# Altium schematic sheet ESP32-C3_V1.SchDoc: ESP32-C3 Haptic Motor (part 3 of 3)
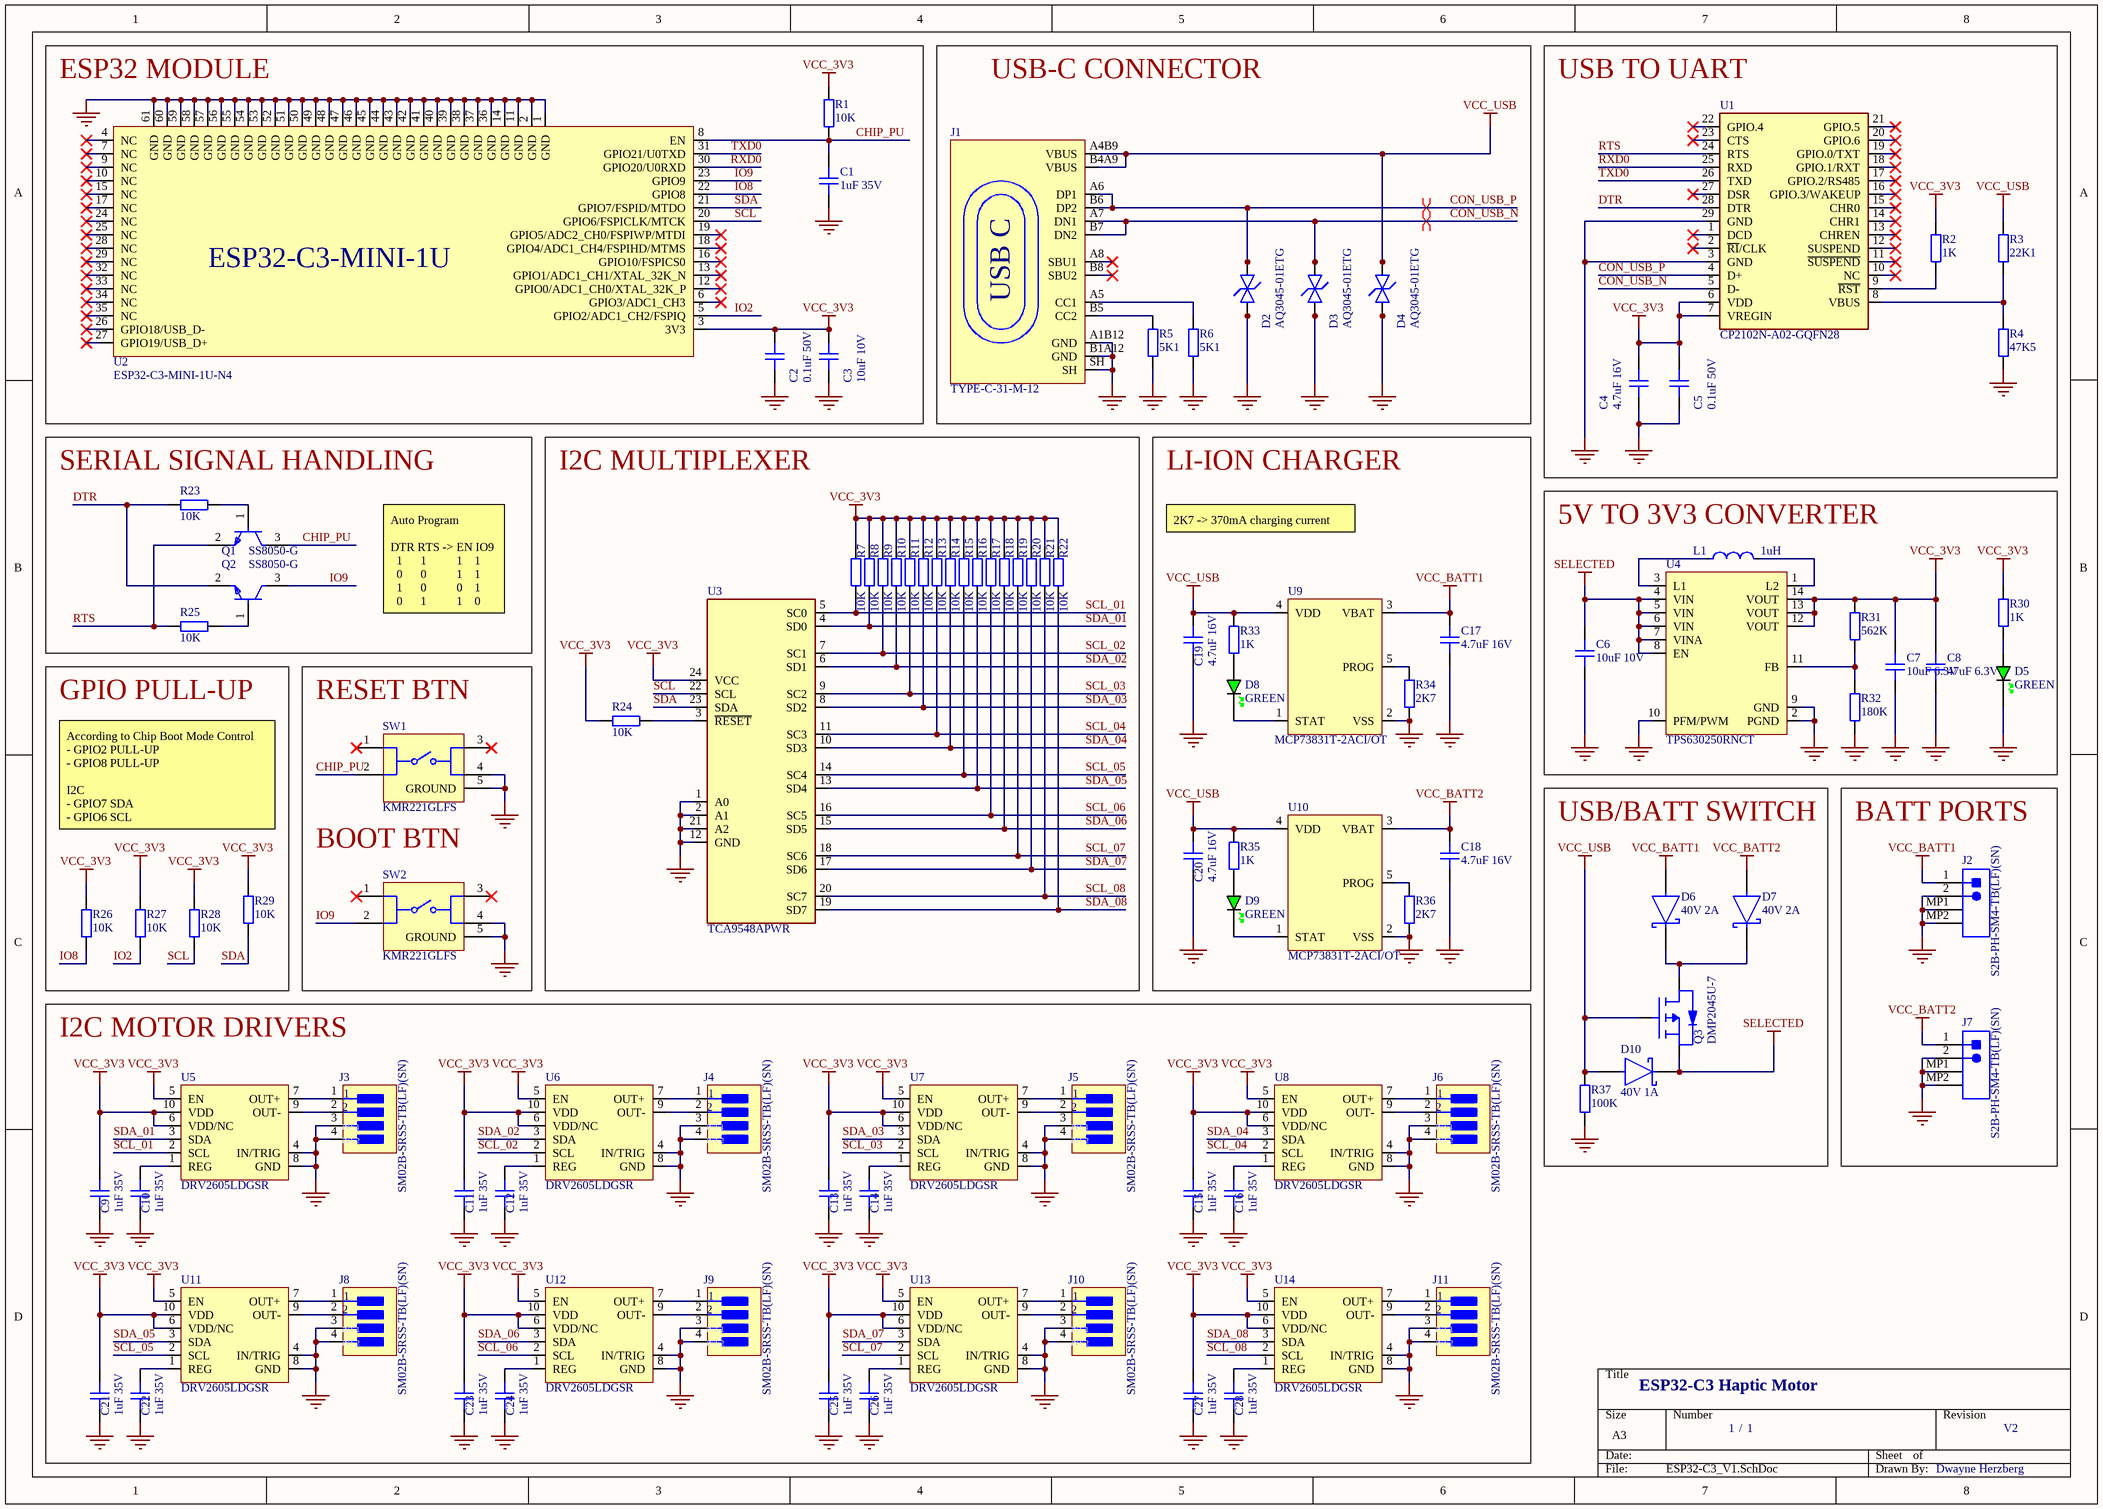
[diagram p2: ESP32-C3_V1.SchDoc]

## Library data of the parts (continued)
U3 = TCA9548APWR: IC BUS SWITCH 1 X 8:1 24TSSOP; Manufacturer: Texas Instruments; Package Body Material: Plastic; Output Polarity: True; Logic Type: MULTIPLEXER; Channels: 1; Number of Outputs: 8; Propagation Delay (tpd): 1ns; Max Supply Voltage: 5.5V; Min Supply Voltage: 1.65V; Nominal Supply Voltage: 1.8V; Supplier: Mouser; Supplier Part Number: 595-TCA9548APWR; Manufacturer Part Number: TCA9548APWR; RoHS: Yes; Category: Decoders and Multiplexers; Stock: 6650; Pricing: 1=1,17, 10=0,765, 50=0,765, 100=0,633, 1000=0,587, 10000=0,534 (USD); Case/Package: TSSOP; Pins: 24; Package Shape: Rectangular; Terminal Finish: Nickel; Min Operating Temperature: -40°C; Max Operating Temperature: 85°C; JESD-609 Code: e4; JESD-30 Code: R-PDSO-G24; Moisture Sensitivity Level: 1; Number of Inputs: 1; Package Style: SMALL OUTLINE, THIN PROFILE, SHRINK PITCHMeter; Peak Reflow Temperature (Cel): 260°C; Surface Mount: Yes; Terminal Form: Gull Wing; Terminal Position: DUAL; Length: 7.8mm; Width: 4.4mm; Height - Seated (Max): 1.2mm; Terminal Pitch: 0.65mm; Reach SVHC Compliant: Yes; RoHS Compliant: Yes; Temperature Grade: INDUSTRIAL; ComponentLink1URL: https://www.ti.com:443/lit/ds/symlink/tca9548a.pdf?src-supplier=IHS+Markit; ComponentLink1Description: https://www.ti.com:443/lit/ds/symlink/tca9548a.pdf?src-supplier=IHS+Markit; ComponentLink2URL: https://datasheet.ciiva.com/6614/tca9548a-6614721.pdf?src-supplier=Digikey; ComponentLink2Description: https://datasheet.ciiva.com/6614/tca9548a-6614721.pdf?src-supplier=Digikey; JLCPCB Part: C130026
U4 = TPS630250RNCT: IC REG BCK BST ADJ 2A/4A 14VQFN; Manufacturer: Texas Instruments; Package Body Material: Plastic; Throw Configuration: SWITCHING REGULATOR; Control Mode: CURRENT-MODE; Control Technique: PULSE WIDTH MODULATION; Max Supply Voltage: 5.5V; Min Input Voltage: 2.3V; Nominal Supply Voltage: 2.8V; Channels: 1; Switcher Configuration: BUCK-BOOST; Frequency: 2.5MHz; Supplier: Digikey; Supplier Part Number: 296-42036-1-ND; Manufacturer Part Number: TPS630250RNCT; RoHS: Yes; Category: Voltage Regulators - Switching; Stock: 15202; Pricing: 1=3,94, 10=2,977, 25=2,736, 100=2,4713 (USD); Case/Package: VQCCN; Pins: 14; Package Shape: Rectangular; Terminal Finish: Nickel; Min Operating Temperature: -40°C; Max Operating Temperature: 85°C; JESD-609 Code: e4; Moisture Sensitivity Level: 1; Package Style: CHIP CARRIER, VERY THIN PROFILEMeter; Surface Mount: Yes; Terminal Form: No Lead; Terminal Position: QUAD; Length: 3mm; Width: 2.5mm; Height - Seated (Max): 1mm; Terminal Pitch: 0.5mm; Temperature Grade: INDUSTRIAL; Reach SVHC Compliant: Yes; RoHS Compliant: Yes; ComponentLink1URL: https://www.ti.com:443/lit/ds/symlink/tps630250.pdf?src-supplier=IHS+Markit; ComponentLink1Description: https://www.ti.com:443/lit/ds/symlink/tps630250.pdf?src-supplier=IHS+Markit; ComponentLink2URL: http://www.ti.com/general/docs/lit/getliterature.tsp?genericPartNumber=TPS630250&&fileType=pdf&src-supplier=Element14; ComponentLink2Description: http://www.ti.com/general/docs/lit/getliterature.tsp?genericPartNumber=TPS630250&&fileType=pdf&src-supplier=Element14; ComponentLink3URL: http://www.ti.com/lit/ds/symlink/tps630250.pdf?src-supplier=Digikey; ComponentLink3Description: http://www.ti.com/lit/ds/symlink/tps630250.pdf?src-supplier=Digikey; ComponentLink4URL: http://www.ti.com/general/docs/lit/getliterature.tsp?genericPartNumber=TPS630251&&fileType=pdf&src-supplier=Avnet; ComponentLink4Description: http://www.ti.com/general/docs/lit/getliterature.tsp?genericPartNumber=TPS630251&&fileType=pdf&src-supplier=Avnet; ComponentLink5URL: http://www.ti.com/general/docs/lit/getliterature.tsp?genericPartNumber=TPS630250&amp;&amp;fileType=pdf&src-supplier=Farnell; ComponentLink5Description: http://www.ti.com/general/docs/lit/getliterature.tsp?genericPartNumber=TPS630250&amp;&amp;fileType=pdf&src-supplier=Farnell; JLCPCB Part: C2070882
U5-U8 U11-U14 = DRV2605LDGSR: IC MOTOR DRIVER 2V-5.5V 10VSSOP; Manufacturer: Texas Instruments; Package Body Material: Plastic; Throw Configuration: ANALOG CIRCUIT; Channels: 1; Max Supply Voltage: 5.2V; Min Supply Voltage: 2V; Nominal Supply Voltage: 3.6V; Supplier: Mouser; Supplier Part Number: 595-DRV2605LDGSR; Manufacturer Part Number: DRV2605LDGSR; RoHS: Yes; Category: Motor Drivers; Stock: 10057; Pricing: 1=2,27, 10=1,61, 50=1,61, 100=1,45, 1000=1,31, 10000=1,3 (USD); Case/Package: TSSOP; Pins: 10; Package Shape: Square; Terminal Finish: Nickel; Min Operating Temperature: -40°C; Max Operating Temperature: 85°C; JESD-609 Code: e4; JESD-30 Code: S-PDSO-G10; Moisture Sensitivity Level: 2; Package Style: SMALL OUTLINE, THIN PROFILE, SHRINK PITCHMeter; Peak Reflow Temperature (Cel): 260°C; Surface Mount: Yes; Terminal Form: Gull Wing; Terminal Position: DUAL; Length: 3mm; Width: 3mm; Height - Seated (Max): 1.1mm; Terminal Pitch: 0.5mm; Temperature Grade: INDUSTRIAL; Reach SVHC Compliant: Yes; RoHS Compliant: Yes; ComponentLink1URL: https://www.ti.com:443/lit/ds/symlink/drv2605l.pdf?src-supplier=IHS+Markit; ComponentLink1Description: https://www.ti.com:443/lit/ds/symlink/drv2605l.pdf?src-supplier=IHS+Markit; ComponentLink2URL: http://www.ti.com/lit/ds/symlink/drv2605l.pdf?src-supplier=Digikey; ComponentLink2Description: http://www.ti.com/lit/ds/symlink/drv2605l.pdf?src-supplier=Digikey; ComponentLink3URL: http://www.ti.com/general/docs/lit/getliterature.tsp?genericPartNumber=DRV2605L&&fileType=pdf&src-supplier=Avnet; ComponentLink3Description: http://www.ti.com/general/docs/lit/getliterature.tsp?genericPartNumber=DRV2605L&&fileType=pdf&src-supplier=Avnet; JLCPCB Part: C527464
U9 U10 = MCP73831T-2ACI/OT: IC BATT CNTL LI-ION 1CEL SOT23-5; Manufacturer: Microchip; Package Body Material: Plastic; Adjustable Threshold: Yes; Throw Configuration: POWER SUPPLY SUPPORT CIRCUIT; Number of Channels: 1; Package Equivalence Code: TSOP5/6,.11,37; Power Supplies: 3.3/5V; Supply Current-Max (Isup): 1.5mA; Max Supply Voltage: 6V; Min Supply Voltage: 3.75V; Nominal Supply Voltage: 5.2V; Time @ Peak Reflow Temperature-Max (s): 40s; Qualification Status: Not Qualified; Supplier: Digikey; Supplier Part Number: MCP73831T-2ACI/OTCT-ND; Manufacturer Part Number: MCP73831T-2ACI/OT; RoHS: Yes; Category: Battery Management; Stock: 84522; Pricing: 1=0,76, 25=0,63, 100=0,6125 (USD); Case/Package: LSSOP; Pins: 5; Package Shape: Rectangular; Terminal Finish: Tin; Min Operating Temperature: -40°C; Max Operating Temperature: 85°C; JESD-609 Code: e3; JESD-30 Code: R-PDSO-G5; Moisture Sensitivity Level: 1; Channels: 1; Package Style: SMALL OUTLINE, LOW PROFILE, SHRINK PITCHMeter; Peak Reflow Temperature (Cel): 260°C; Surface Mount: Yes; Terminal Form: Gull Wing; Terminal Position: DUAL; Length: 2.95mm; Width: 1.65mm; Height - Seated (Max): 1.45mm; Terminal Pitch: 0.95mm; Temperature Grade: INDUSTRIAL; Reach SVHC Compliant: Yes; RoHS Compliant: Yes; ComponentLink1URL: https://datasheet.ciiva.com:443/pdfs/VipMasterIC/IC/MCHP/MCHPS05673/MCHPS05673-1.pdf?src-supplier=IHS+Markit; ComponentLink1Description: https://datasheet.ciiva.com:443/pdfs/VipMasterIC/IC/MCHP/MCHPS05673/MCHPS05673-1.pdf?src-supplier=IHS+Markit; ComponentLink2URL: https://datasheet.ciiva.com/22828/0900766b80d2b53a-22828876.pdf?src-supplier=Rs; ComponentLink2Description: https://datasheet.ciiva.com/22828/0900766b80d2b53a-22828876.pdf?src-supplier=Rs; ComponentLink3URL: https://datasheet.ciiva.com/26344/651521-da-01-en-contr-mcp73831t-2aci-ot-sot-23-5-mcp-26344458.pdf?src-supplier=Conrad; ComponentLink3Description: https://datasheet.ciiva.com/26344/651521-da-01-en-contr-mcp73831t-2aci-ot-sot-23-5-mcp-26344458.pdf?src-supplier=Conrad; ComponentLink4URL: https://datasheet.ciiva.com/1137/630369-1137803.pdf?src-supplier=Element14; ComponentLink4Description: https://datasheet.ciiva.com/1137/630369-1137803.pdf?src-supplier=Element14; ComponentLink5URL: https://datasheet.ciiva.com/46385/630369-46385324.pdf?src-supplier=Element14; ComponentLink5Description: https://datasheet.ciiva.com/46385/630369-46385324.pdf?src-supplier=Element14; ComponentLink6URL: https://datasheet.ciiva.com/16286/filehandler-aspxddocname-en025112-16286957.pdf?src-supplier=Future+Electronics; ComponentLink6Description: https://datasheet.ciiva.com/16286/filehandler-aspxddocname-en025112-16286957.pdf?src-supplier=Future+Electronics; ComponentLink7URL: https://datasheet.ciiva.com/1931/21984e-1931954.pdf?src-supplier=Digikey; ComponentLink7Description: https://datasheet.ciiva.com/1931/21984e-1931954.pdf?src-supplier=Digikey; ComponentLink8URL: https://datasheet.ciiva.com/1931/21984e-1931955.pdf?src-supplier=Digikey; ComponentLink8Description: https://datasheet.ciiva.com/1931/21984e-1931955.pdf?src-supplier=Digikey; ComponentLink9URL: https://datasheet.ciiva.com/1931/21984e-1931953.pdf?src-supplier=Digikey; ComponentLink9Description: https://datasheet.ciiva.com/1931/21984e-1931953.pdf?src-supplier=Digikey; ComponentLink10URL: https://datasheet.ciiva.com/28626/630369-28626439.pdf?src-supplier=Element14; ComponentLink10Description: https://datasheet.ciiva.com/28626/630369-28626439.pdf?src-supplier=Element14; ComponentLink11URL: https://datasheet.ciiva.com/1144/630369-1144461.pdf?src-supplier=Newark; ComponentLink11Description: https://datasheet.ciiva.com/1144/630369-1144461.pdf?src-supplier=Newark; JLCPCB Part: C424093